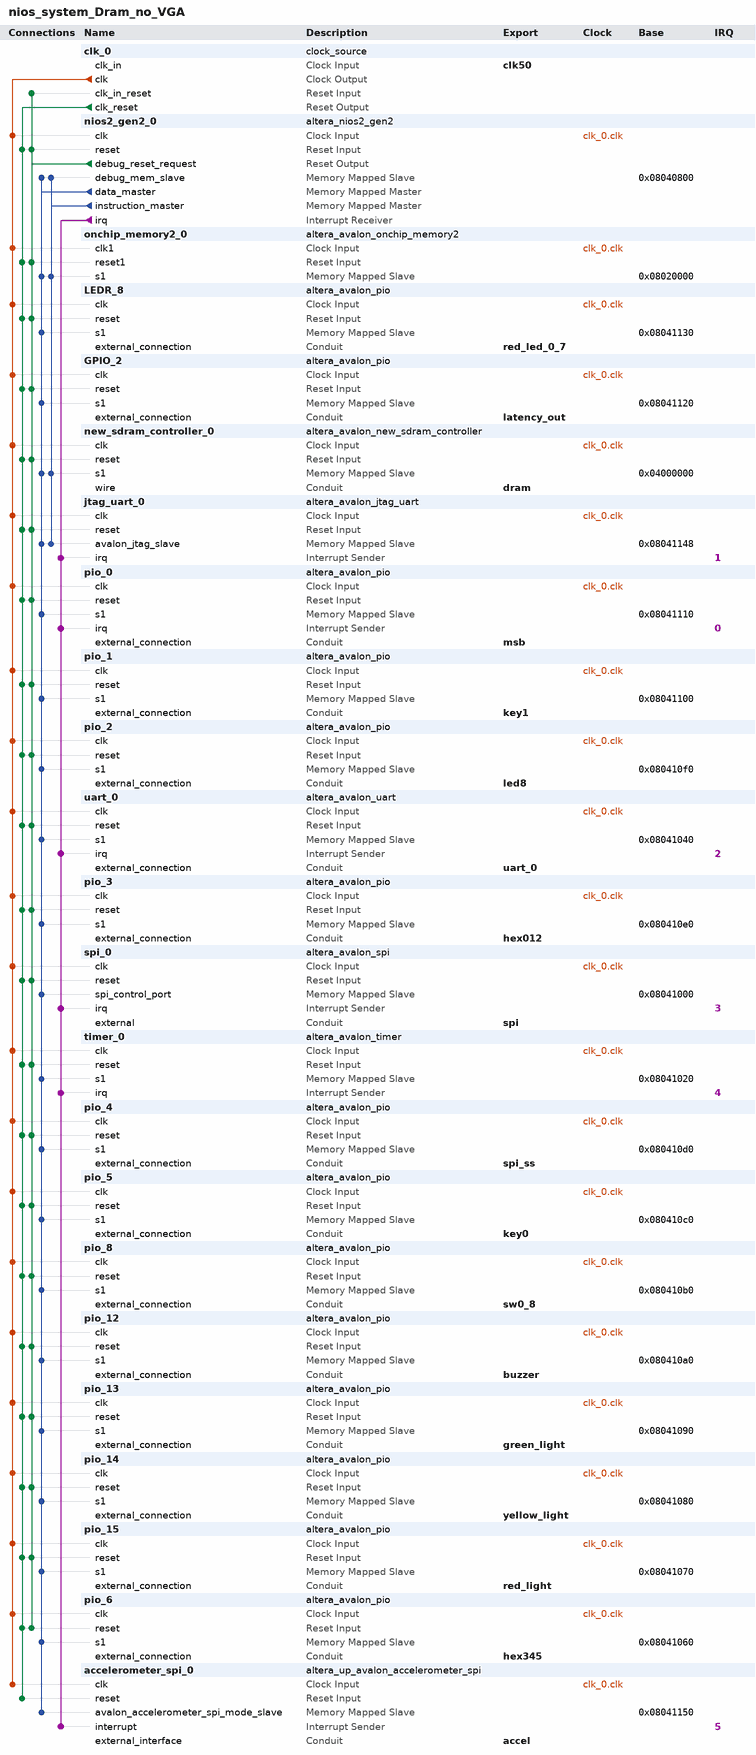
[diagram p0: system contents]
# Platform Designer (Qsys) system nios_system_Dram_no_VGA, MAX 10 10M50DAF484C7G
# Parameters at their usual value, and those the tool derives, are not listed.
package require -exact qsys 18.1
create_system nios_system_Dram_no_VGA
set_project_property DEVICE_FAMILY {MAX 10}
set_project_property DEVICE 10M50DAF484C7G

add_instance clk_0 clock_source 18.1
set_instance_parameter_value clk_0 clockFrequency 50000000

add_instance nios2_gen2_0 altera_nios2_gen2 18.1
set_instance_parameter_value nios2_gen2_0 dcache_size 2048
set_instance_parameter_value nios2_gen2_0 exceptionSlave new_sdram_controller_0.s1
set_instance_parameter_value nios2_gen2_0 icache_size 4096
set_instance_parameter_value nios2_gen2_0 impl Fast
set_instance_parameter_value nios2_gen2_0 resetSlave new_sdram_controller_0.s1

add_instance onchip_memory2_0 altera_avalon_onchip_memory2 18.1
set_instance_parameter_value onchip_memory2_0 dataWidth 32
set_instance_parameter_value onchip_memory2_0 dualPort false
set_instance_parameter_value onchip_memory2_0 initMemContent false
set_instance_parameter_value onchip_memory2_0 initializationFileName onchip_mem.hex
set_instance_parameter_value onchip_memory2_0 memorySize 131072

add_instance LEDR_8 altera_avalon_pio 18.1
set_instance_parameter_value LEDR_8 direction Output
set_instance_parameter_value LEDR_8 width 8

add_instance GPIO_2 altera_avalon_pio 18.1
set_instance_parameter_value GPIO_2 direction Output
set_instance_parameter_value GPIO_2 width 1

add_instance new_sdram_controller_0 altera_avalon_new_sdram_controller 18.1
set_instance_parameter_value new_sdram_controller_0 TAC 5.5
set_instance_parameter_value new_sdram_controller_0 TRCD 20.0
set_instance_parameter_value new_sdram_controller_0 TRP 20.0
set_instance_parameter_value new_sdram_controller_0 casLatency 3
set_instance_parameter_value new_sdram_controller_0 columnWidth 10
set_instance_parameter_value new_sdram_controller_0 dataWidth 16
set_instance_parameter_value new_sdram_controller_0 generateSimulationModel false
set_instance_parameter_value new_sdram_controller_0 model single_Micron_MT48LC4M32B2_7_chip
set_instance_parameter_value new_sdram_controller_0 numberOfBanks 4
set_instance_parameter_value new_sdram_controller_0 numberOfChipSelects 1
set_instance_parameter_value new_sdram_controller_0 powerUpDelay 100.0
set_instance_parameter_value new_sdram_controller_0 refreshPeriod 15.625
set_instance_parameter_value new_sdram_controller_0 rowWidth 13

add_instance jtag_uart_0 altera_avalon_jtag_uart 18.1
set_instance_parameter_value jtag_uart_0 simInteractiveOptions NO_INTERACTIVE_WINDOWS

add_instance pio_0 altera_avalon_pio 18.1
set_instance_parameter_value pio_0 captureEdge true
set_instance_parameter_value pio_0 direction Input
set_instance_parameter_value pio_0 generateIRQ true
set_instance_parameter_value pio_0 irqType EDGE
set_instance_parameter_value pio_0 width 1

add_instance pio_1 altera_avalon_pio 18.1
set_instance_parameter_value pio_1 direction Input
set_instance_parameter_value pio_1 width 1

add_instance pio_2 altera_avalon_pio 18.1
set_instance_parameter_value pio_2 direction Output
set_instance_parameter_value pio_2 width 1

add_instance uart_0 altera_avalon_uart 18.1
set_instance_parameter_value uart_0 baud 9600
set_instance_parameter_value uart_0 dataBits 8
set_instance_parameter_value uart_0 fixedBaud true
set_instance_parameter_value uart_0 parity NONE
set_instance_parameter_value uart_0 stopBits 1

add_instance pio_3 altera_avalon_pio 18.1
set_instance_parameter_value pio_3 direction Output
set_instance_parameter_value pio_3 width 24

add_instance spi_0 altera_avalon_spi 18.1
set_instance_parameter_value spi_0 clockPolarity 0
set_instance_parameter_value spi_0 dataWidth 8
set_instance_parameter_value spi_0 masterSPI true
set_instance_parameter_value spi_0 numberOfSlaves 1
set_instance_parameter_value spi_0 targetClockRate 128000

add_instance timer_0 altera_avalon_timer 18.1
set_instance_parameter_value timer_0 period 1
set_instance_parameter_value timer_0 periodUnits MSEC

add_instance pio_4 altera_avalon_pio 18.1
set_instance_parameter_value pio_4 direction Output
set_instance_parameter_value pio_4 width 1

add_instance pio_5 altera_avalon_pio 18.1
set_instance_parameter_value pio_5 direction Input
set_instance_parameter_value pio_5 width 1

add_instance pio_8 altera_avalon_pio 18.1
set_instance_parameter_value pio_8 direction Input
set_instance_parameter_value pio_8 width 9

add_instance pio_12 altera_avalon_pio 18.1
set_instance_parameter_value pio_12 direction Output
set_instance_parameter_value pio_12 width 1

add_instance pio_13 altera_avalon_pio 18.1
set_instance_parameter_value pio_13 direction Output
set_instance_parameter_value pio_13 width 1

add_instance pio_14 altera_avalon_pio 18.1
set_instance_parameter_value pio_14 direction Output
set_instance_parameter_value pio_14 width 1

add_instance pio_15 altera_avalon_pio 18.1
set_instance_parameter_value pio_15 direction Output
set_instance_parameter_value pio_15 width 1

add_instance pio_6 altera_avalon_pio 18.1
set_instance_parameter_value pio_6 direction Output
set_instance_parameter_value pio_6 width 24

add_instance accelerometer_spi_0 altera_up_avalon_accelerometer_spi 18.0

# connections
add_connection clk_0.clk accelerometer_spi_0.clk clock
add_connection clk_0.clk GPIO_2.clk clock
add_connection clk_0.clk jtag_uart_0.clk clock
add_connection clk_0.clk LEDR_8.clk clock
add_connection clk_0.clk new_sdram_controller_0.clk clock
add_connection clk_0.clk nios2_gen2_0.clk clock
add_connection clk_0.clk onchip_memory2_0.clk1 clock
add_connection clk_0.clk pio_0.clk clock
add_connection clk_0.clk pio_1.clk clock
add_connection clk_0.clk pio_2.clk clock
add_connection clk_0.clk pio_3.clk clock
add_connection clk_0.clk pio_4.clk clock
add_connection clk_0.clk pio_5.clk clock
add_connection clk_0.clk pio_6.clk clock
add_connection clk_0.clk pio_8.clk clock
add_connection clk_0.clk pio_12.clk clock
add_connection clk_0.clk pio_13.clk clock
add_connection clk_0.clk pio_14.clk clock
add_connection clk_0.clk pio_15.clk clock
add_connection clk_0.clk spi_0.clk clock
add_connection clk_0.clk timer_0.clk clock
add_connection clk_0.clk uart_0.clk clock
add_connection clk_0.clk_reset accelerometer_spi_0.reset reset
add_connection clk_0.clk_reset GPIO_2.reset reset
add_connection clk_0.clk_reset jtag_uart_0.reset reset
add_connection clk_0.clk_reset LEDR_8.reset reset
add_connection clk_0.clk_reset new_sdram_controller_0.reset reset
add_connection clk_0.clk_reset nios2_gen2_0.reset reset
add_connection clk_0.clk_reset onchip_memory2_0.reset1 reset
add_connection clk_0.clk_reset pio_0.reset reset
add_connection clk_0.clk_reset pio_1.reset reset
add_connection clk_0.clk_reset pio_2.reset reset
add_connection clk_0.clk_reset pio_3.reset reset
add_connection clk_0.clk_reset pio_4.reset reset
add_connection clk_0.clk_reset pio_5.reset reset
add_connection clk_0.clk_reset pio_6.reset reset
add_connection clk_0.clk_reset pio_8.reset reset
add_connection clk_0.clk_reset pio_12.reset reset
add_connection clk_0.clk_reset pio_13.reset reset
add_connection clk_0.clk_reset pio_14.reset reset
add_connection clk_0.clk_reset pio_15.reset reset
add_connection clk_0.clk_reset spi_0.reset reset
add_connection clk_0.clk_reset timer_0.reset reset
add_connection clk_0.clk_reset uart_0.reset reset
add_connection nios2_gen2_0.debug_reset_request clk_0.clk_in_reset reset
add_connection nios2_gen2_0.debug_reset_request GPIO_2.reset reset
add_connection nios2_gen2_0.debug_reset_request jtag_uart_0.reset reset
add_connection nios2_gen2_0.debug_reset_request LEDR_8.reset reset
add_connection nios2_gen2_0.debug_reset_request new_sdram_controller_0.reset reset
add_connection nios2_gen2_0.debug_reset_request nios2_gen2_0.reset reset
add_connection nios2_gen2_0.debug_reset_request onchip_memory2_0.reset1 reset
add_connection nios2_gen2_0.debug_reset_request pio_0.reset reset
add_connection nios2_gen2_0.debug_reset_request pio_1.reset reset
add_connection nios2_gen2_0.debug_reset_request pio_2.reset reset
add_connection nios2_gen2_0.debug_reset_request pio_3.reset reset
add_connection nios2_gen2_0.debug_reset_request pio_4.reset reset
add_connection nios2_gen2_0.debug_reset_request pio_5.reset reset
add_connection nios2_gen2_0.debug_reset_request pio_6.reset reset
add_connection nios2_gen2_0.debug_reset_request pio_8.reset reset
add_connection nios2_gen2_0.debug_reset_request pio_12.reset reset
add_connection nios2_gen2_0.debug_reset_request pio_13.reset reset
add_connection nios2_gen2_0.debug_reset_request pio_14.reset reset
add_connection nios2_gen2_0.debug_reset_request pio_15.reset reset
add_connection nios2_gen2_0.debug_reset_request spi_0.reset reset
add_connection nios2_gen2_0.debug_reset_request timer_0.reset reset
add_connection nios2_gen2_0.debug_reset_request uart_0.reset reset
add_connection nios2_gen2_0.data_master accelerometer_spi_0.avalon_accelerometer_spi_mode_slave avalon
set_connection_parameter_value nios2_gen2_0.data_master/accelerometer_spi_0.avalon_accelerometer_spi_mode_slave baseAddress 0x08041150
add_connection nios2_gen2_0.data_master GPIO_2.s1 avalon
set_connection_parameter_value nios2_gen2_0.data_master/GPIO_2.s1 baseAddress 0x08041120
add_connection nios2_gen2_0.data_master jtag_uart_0.avalon_jtag_slave avalon
set_connection_parameter_value nios2_gen2_0.data_master/jtag_uart_0.avalon_jtag_slave baseAddress 0x08041148
add_connection nios2_gen2_0.data_master LEDR_8.s1 avalon
set_connection_parameter_value nios2_gen2_0.data_master/LEDR_8.s1 baseAddress 0x08041130
add_connection nios2_gen2_0.data_master new_sdram_controller_0.s1 avalon
set_connection_parameter_value nios2_gen2_0.data_master/new_sdram_controller_0.s1 baseAddress 0x04000000
add_connection nios2_gen2_0.data_master nios2_gen2_0.debug_mem_slave avalon
set_connection_parameter_value nios2_gen2_0.data_master/nios2_gen2_0.debug_mem_slave baseAddress 0x08040800
add_connection nios2_gen2_0.data_master onchip_memory2_0.s1 avalon
set_connection_parameter_value nios2_gen2_0.data_master/onchip_memory2_0.s1 baseAddress 0x08020000
add_connection nios2_gen2_0.data_master pio_0.s1 avalon
set_connection_parameter_value nios2_gen2_0.data_master/pio_0.s1 baseAddress 0x08041110
add_connection nios2_gen2_0.data_master pio_1.s1 avalon
set_connection_parameter_value nios2_gen2_0.data_master/pio_1.s1 baseAddress 0x08041100
add_connection nios2_gen2_0.data_master pio_2.s1 avalon
set_connection_parameter_value nios2_gen2_0.data_master/pio_2.s1 baseAddress 0x080410f0
add_connection nios2_gen2_0.data_master pio_3.s1 avalon
set_connection_parameter_value nios2_gen2_0.data_master/pio_3.s1 baseAddress 0x080410e0
add_connection nios2_gen2_0.data_master pio_4.s1 avalon
set_connection_parameter_value nios2_gen2_0.data_master/pio_4.s1 baseAddress 0x080410d0
add_connection nios2_gen2_0.data_master pio_5.s1 avalon
set_connection_parameter_value nios2_gen2_0.data_master/pio_5.s1 baseAddress 0x080410c0
add_connection nios2_gen2_0.data_master pio_6.s1 avalon
set_connection_parameter_value nios2_gen2_0.data_master/pio_6.s1 baseAddress 0x08041060
add_connection nios2_gen2_0.data_master pio_8.s1 avalon
set_connection_parameter_value nios2_gen2_0.data_master/pio_8.s1 baseAddress 0x080410b0
add_connection nios2_gen2_0.data_master pio_12.s1 avalon
set_connection_parameter_value nios2_gen2_0.data_master/pio_12.s1 baseAddress 0x080410a0
add_connection nios2_gen2_0.data_master pio_13.s1 avalon
set_connection_parameter_value nios2_gen2_0.data_master/pio_13.s1 baseAddress 0x08041090
add_connection nios2_gen2_0.data_master pio_14.s1 avalon
set_connection_parameter_value nios2_gen2_0.data_master/pio_14.s1 baseAddress 0x08041080
add_connection nios2_gen2_0.data_master pio_15.s1 avalon
set_connection_parameter_value nios2_gen2_0.data_master/pio_15.s1 baseAddress 0x08041070
add_connection nios2_gen2_0.data_master spi_0.spi_control_port avalon
set_connection_parameter_value nios2_gen2_0.data_master/spi_0.spi_control_port baseAddress 0x08041000
add_connection nios2_gen2_0.data_master timer_0.s1 avalon
set_connection_parameter_value nios2_gen2_0.data_master/timer_0.s1 baseAddress 0x08041020
add_connection nios2_gen2_0.data_master uart_0.s1 avalon
set_connection_parameter_value nios2_gen2_0.data_master/uart_0.s1 baseAddress 0x08041040
add_connection nios2_gen2_0.instruction_master jtag_uart_0.avalon_jtag_slave avalon
set_connection_parameter_value nios2_gen2_0.instruction_master/jtag_uart_0.avalon_jtag_slave baseAddress 0x08041148
add_connection nios2_gen2_0.instruction_master new_sdram_controller_0.s1 avalon
set_connection_parameter_value nios2_gen2_0.instruction_master/new_sdram_controller_0.s1 baseAddress 0x04000000
add_connection nios2_gen2_0.instruction_master nios2_gen2_0.debug_mem_slave avalon
set_connection_parameter_value nios2_gen2_0.instruction_master/nios2_gen2_0.debug_mem_slave baseAddress 0x08040800
add_connection nios2_gen2_0.instruction_master onchip_memory2_0.s1 avalon
set_connection_parameter_value nios2_gen2_0.instruction_master/onchip_memory2_0.s1 baseAddress 0x08020000
add_connection nios2_gen2_0.irq accelerometer_spi_0.interrupt interrupt
set_connection_parameter_value nios2_gen2_0.irq/accelerometer_spi_0.interrupt irqNumber 5
add_connection nios2_gen2_0.irq jtag_uart_0.irq interrupt
set_connection_parameter_value nios2_gen2_0.irq/jtag_uart_0.irq irqNumber 1
add_connection nios2_gen2_0.irq pio_0.irq interrupt
set_connection_parameter_value nios2_gen2_0.irq/pio_0.irq irqNumber 0
add_connection nios2_gen2_0.irq spi_0.irq interrupt
set_connection_parameter_value nios2_gen2_0.irq/spi_0.irq irqNumber 3
add_connection nios2_gen2_0.irq timer_0.irq interrupt
set_connection_parameter_value nios2_gen2_0.irq/timer_0.irq irqNumber 4
add_connection nios2_gen2_0.irq uart_0.irq interrupt
set_connection_parameter_value nios2_gen2_0.irq/uart_0.irq irqNumber 2

# exported interfaces
add_interface accel conduit end
set_interface_property accel EXPORT_OF accelerometer_spi_0.external_interface
add_interface buzzer conduit end
set_interface_property buzzer EXPORT_OF pio_12.external_connection
add_interface clk50 clock sink
set_interface_property clk50 EXPORT_OF clk_0.clk_in
add_interface dram conduit end
set_interface_property dram EXPORT_OF new_sdram_controller_0.wire
add_interface green_light conduit end
set_interface_property green_light EXPORT_OF pio_13.external_connection
add_interface hex012 conduit end
set_interface_property hex012 EXPORT_OF pio_3.external_connection
add_interface hex345 conduit end
set_interface_property hex345 EXPORT_OF pio_6.external_connection
add_interface key0 conduit end
set_interface_property key0 EXPORT_OF pio_5.external_connection
add_interface key1 conduit end
set_interface_property key1 EXPORT_OF pio_1.external_connection
add_interface latency_out conduit end
set_interface_property latency_out EXPORT_OF GPIO_2.external_connection
add_interface led8 conduit end
set_interface_property led8 EXPORT_OF pio_2.external_connection
add_interface msb conduit end
set_interface_property msb EXPORT_OF pio_0.external_connection
add_interface red_led_0_7 conduit end
set_interface_property red_led_0_7 EXPORT_OF LEDR_8.external_connection
add_interface red_light conduit end
set_interface_property red_light EXPORT_OF pio_15.external_connection
add_interface spi conduit end
set_interface_property spi EXPORT_OF spi_0.external
add_interface spi_ss conduit end
set_interface_property spi_ss EXPORT_OF pio_4.external_connection
add_interface sw0_8 conduit end
set_interface_property sw0_8 EXPORT_OF pio_8.external_connection
add_interface uart_0 conduit end
set_interface_property uart_0 EXPORT_OF uart_0.external_connection
add_interface yellow_light conduit end
set_interface_property yellow_light EXPORT_OF pio_14.external_connection

set_interconnect_requirement {$system} qsys_mm.clockCrossingAdapter HANDSHAKE
set_interconnect_requirement {$system} qsys_mm.enableEccProtection FALSE
set_interconnect_requirement {$system} qsys_mm.insertDefaultSlave FALSE
set_interconnect_requirement {$system} qsys_mm.maxAdditionalLatency 1

save_system nios_system_Dram_no_VGA.qsys
